# Altium schematic sheet Power_PMIC.SchDoc: Power_PMIC
size A3; Project: STM32MP15-DISCO PI; Date: Not used; ApprovedBy: Not used; CheckedBy: Not used; Author: Not used; CompanyName: STMicroelectronics; DrawnBy: Not used; Engineer: Not used; Organization: Not used; Address1: Not used; Address2: Not used; Address3: Not used; Address4: Not used; DocumentNumber: 4; Revision: Not used; SheetNumber: 5; SheetTotal: 15; CurrentTime: Not used; CurrentDate: Not used; Time: Not used; DocumentFullPathAndName: Not used; DocumentName: Not used; ModifiedDate: Not used; ImagePath: Not used; ProjectName: Not used; Application_BuildNumber: Not used
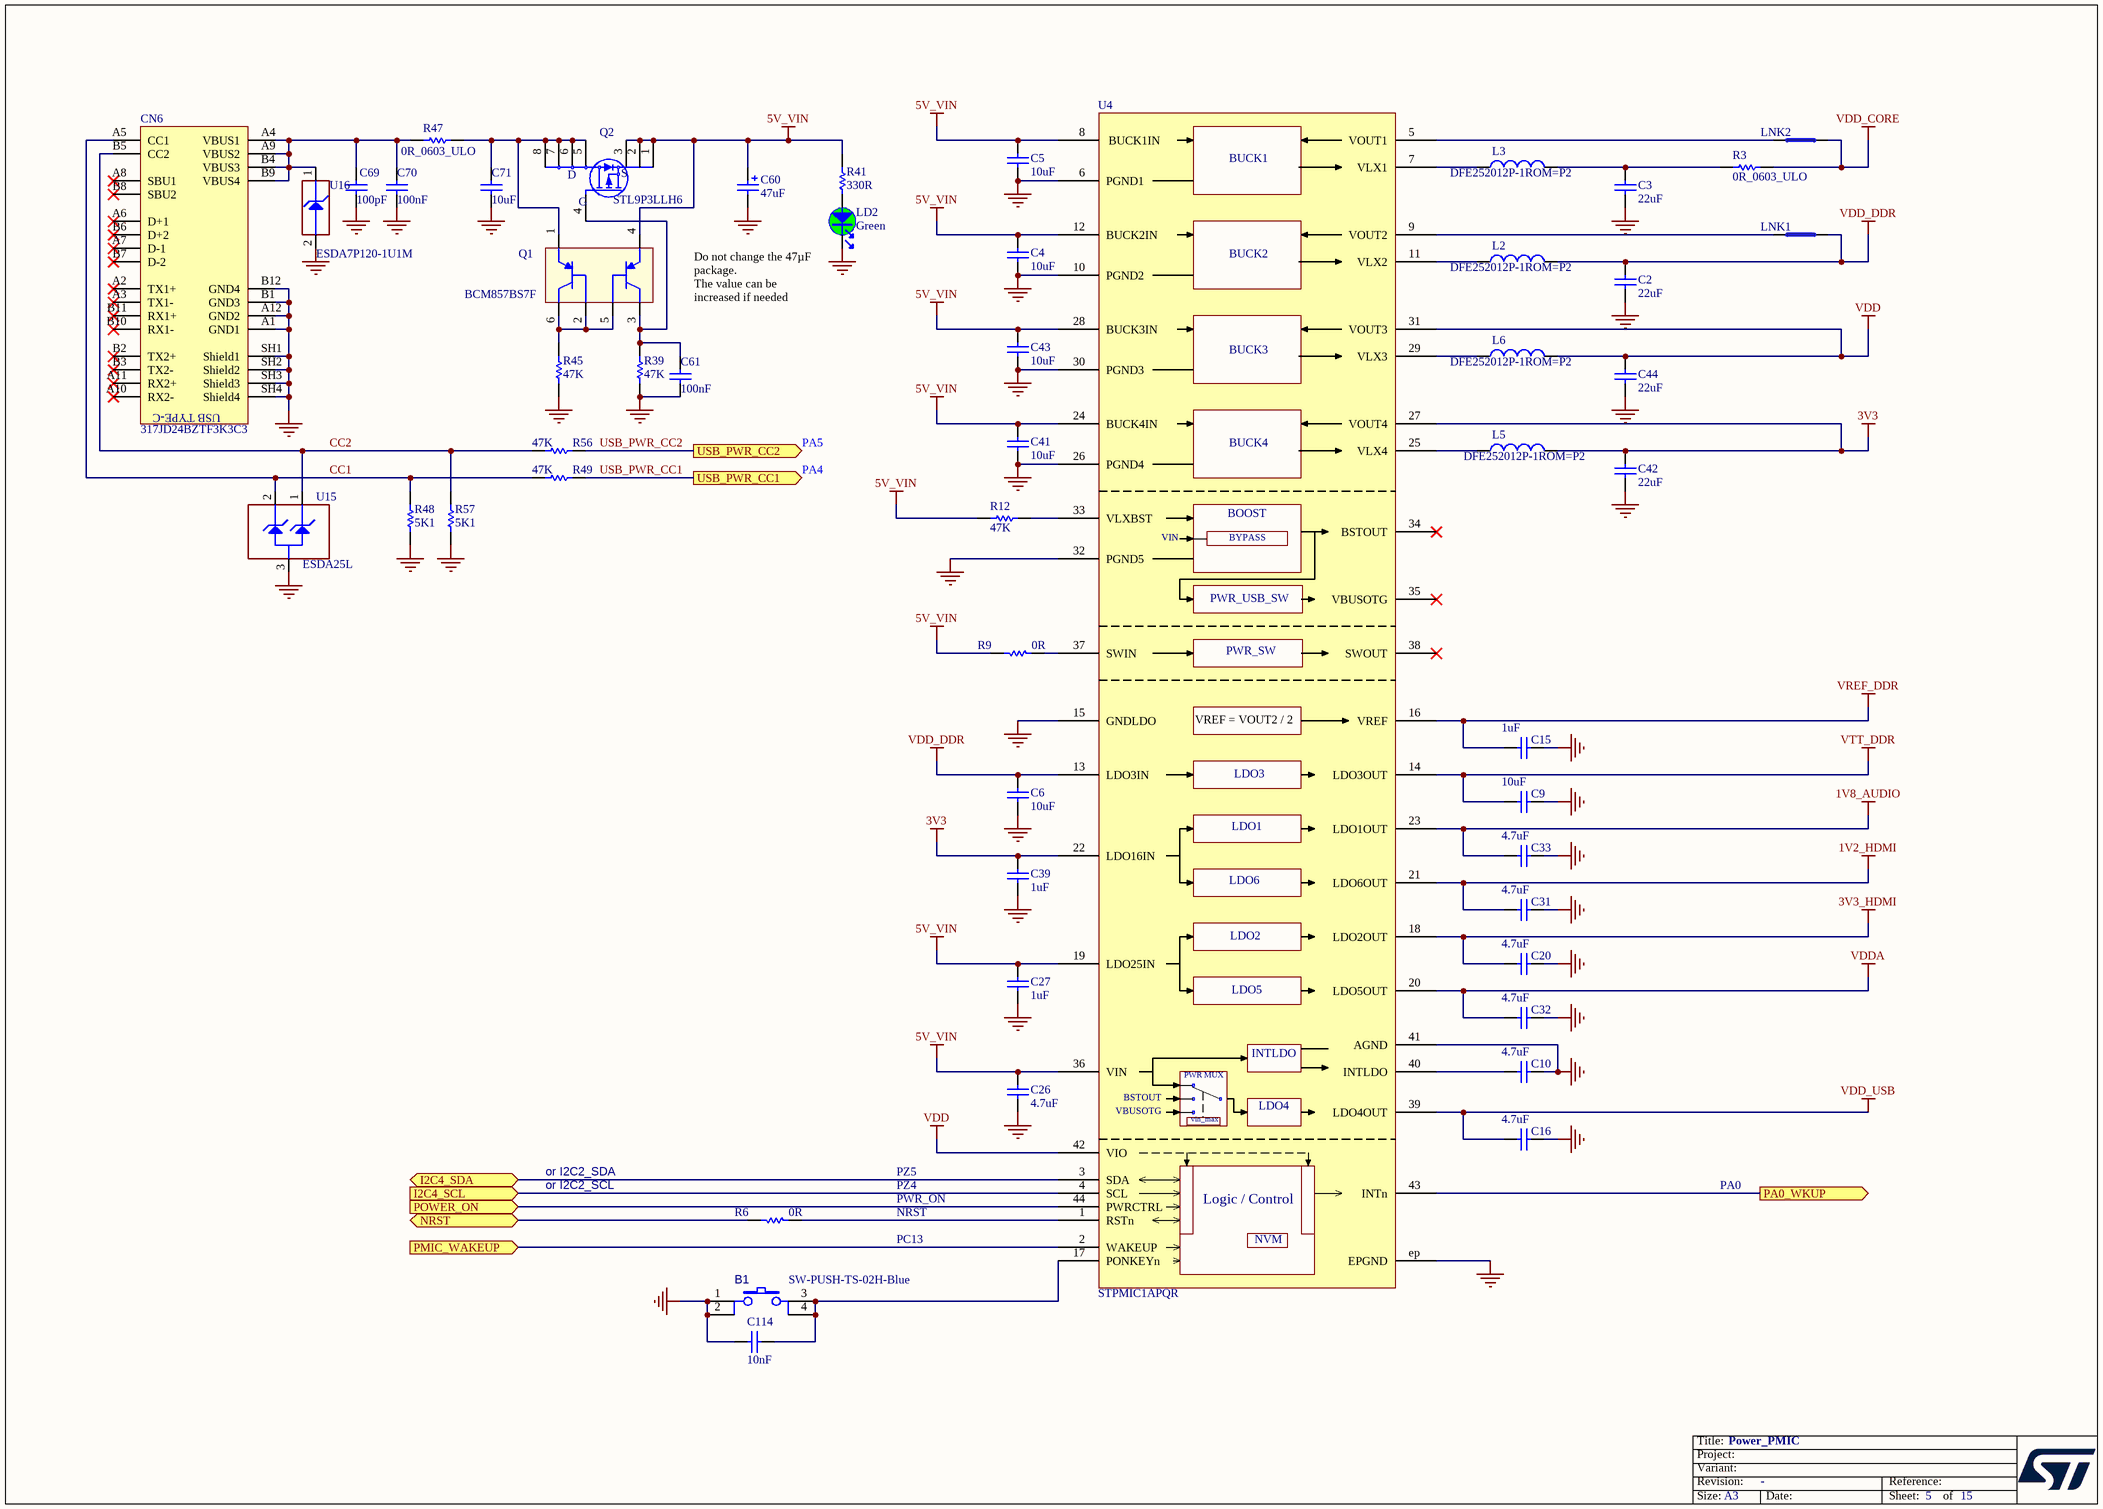
[diagram p0: Power_PMIC.SchDoc]

## Parts
B1  value SW-PUSH-TS-02H-Blue  [SWI_JIUBABA_C-TS-02H-2-5-B-V-T_R_BLUE]
C2  value 22uF  [C0603]
C3  value 22uF  [C0603]
C4  value 10uF  [C0603]
C5  value 10uF  [C0603]
C6  value 10uF  [C0603]
C9  value 10uF  [C0603]
C10  value 4.7uF  [C0402]  (hidden comment: Capacitor)
C15  value 1uF  [C0402]
C16  value 4.7uF  [C0402]  (hidden comment: Capacitor)
C20  value 4.7uF  [C0402]  (hidden comment: Capacitor)
C26  value 4.7uF  [C0402]  (hidden comment: Capacitor)
C27  value 1uF  [C0402]
C31  value 4.7uF  [C0402]  (hidden comment: Capacitor)
C32  value 4.7uF  [C0402]  (hidden comment: Capacitor)
C33  value 4.7uF  [C0402]  (hidden comment: Capacitor)
C39  value 1uF  [C0402]
C41  value 10uF  [C0603]
C42  value 22uF  [C0603]
C43  value 10uF  [C0603]
C44  value 22uF  [C0603]
C60  value 47uF  [CPOL_TAJ-C_2312_H2P6]  (hidden comment: Cap_POL_TANA)
C61  value 100nF  [C0402]
C69  value 100pF  [C0402]  (hidden comment: Capacitor)
C70  value 100nF  [C0402]
C71  value 10uF  [C0805]  (hidden comment: Capacitor)
C114  value 10nF  [C0402]
CN6  value 317JD24BZTF3K3C3  [CON_USB-TYPEC_COXOC_317JD24BZTF3K3C3]
L2  Manufacturer_Part_Number: DFE252012P-1ROM=P2  [IND_2520_TOKO_DFE252012P]  (hidden comment: IND_1uH_42mohm_3.2A)
L3  Manufacturer_Part_Number: DFE252012P-1ROM=P2  [IND_2520_TOKO_DFE252012P]  (hidden comment: IND_1uH_42mohm_3.2A)
L5  Manufacturer_Part_Number: DFE252012P-1ROM=P2  [IND_2520_TOKO_DFE252012P]  (hidden comment: IND_1uH_42mohm_3.2A)
L6  Manufacturer_Part_Number: DFE252012P-1ROM=P2  [IND_2520_TOKO_DFE252012P]  (hidden comment: IND_1uH_42mohm_3.2A)
LD2  value Green  [LED_0603_GREEN]  (hidden comment: LED_green)
LNK1  link_200  [LINK200]  (value not drawn)  (no BOM)
LNK2  link_200  [LINK200]  (value not drawn)  (no BOM)
Q1  value BCM857BS7F  [DIO_SOT363]
Q2  value STL9P3LLH6  [MOS_POWERFLAT_3P3X3P3_P065]
R3  value 0R_0603_ULO  [R0603]
R6  value 0R  [R0402]
R9  value 0R  [R0402]
R12  value 47K  [R0402]  (hidden comment: Resistor)
R39  value 47K  [R0402]  (hidden comment: Resistor)
R41  value 330R  [R0402]
R45  value 47K  [R0402]  (hidden comment: Resistor)
R47  value 0R_0603_ULO  [R0603]
R48  value 5K1  [R0402]  (hidden comment: Resistor)
R49  value 47K  [R0402]  (hidden comment: Resistor)
R56  value 47K  [R0402]  (hidden comment: Resistor)
R57  value 5K1  [R0402]  (hidden comment: Resistor)
U4  value STPMIC1APQR  [ICC_WFQFN44-EPAD_5X6_P040]  (hidden comment: STPMU1)
U15  value ESDA25L  [ESD_SOT23]  (hidden comment: New schematic symbol : correction 2 diodes instead of one)
U16  value ESDA7P120-1U1M  [ESD_QFN1610_2N_1K_2A]  (hidden comment: ​Footprint needed DFN105P160X60-2N)

## Ports
I2C4_SCL (in), I2C4_SDA (bidir), NRST (bidir), PA0_WKUP (out), PMIC_WAKEUP (in), POWER_ON (in), USB_PWR_CC1 (out), USB_PWR_CC2 (out)

## Nets
1V2_HDMI: C31.2 U4.21(LDO6OUT)
1V8_AUDIO: C33.2 U4.23(LDO1OUT)
3V3: C39.2 C42.2 L5.2 U4.22(LDO16IN) U4.27(VOUT4)
3V3_HDMI: C20.2 U4.18(LDO2OUT)
5V_VIN: C4.2 C5.2 C26.2 C27.2 C41.2 C43.2 C60.1 Q1.4(E2) Q2.1(S) Q2.2(S) Q2.3(S) R9.1 R12.2 R41.2 U4.8(BUCK1IN) U4.12(BUCK2IN) U4.19(LDO25IN) U4.24(BUCK4IN) U4.28(BUCK3IN) U4.36(VIN)
GND: B1.1 B1.2 C2.1 C3.1 C4.1 C5.1 C6.1 C9.1 C10.2 C15.1 C16.1 C20.1 C26.1 C27.1 C31.1 C32.1 C33.1 C39.1 C41.1 C42.1 C43.1 C44.1 C60.2 C61.2 C69.1 C70.2 C71.1 C114.1 CN6.A1(GND1) CN6.A12(GND2) CN6.B1(GND3) CN6.B12(GND4) CN6.SH1(Shield1) CN6.SH2(Shield2) CN6.SH3(Shield3) CN6.SH4(Shield4) LD2.2 R39.1 R45.1 R48.1 R57.1 U4.6(PGND1) U4.10(PGND2) U4.15(GNDLDO) U4.26(PGND4) U4.30(PGND3) U4.32(PGND5) U4.41(AGND) U4.ep(EPGND) U15.3(GND) U16.2(GND)
VDD: C44.2 L6.2 U4.31(VOUT3) U4.42(VIO)
VDD_CORE: LNK2.2 R3.2
VDD_DDR: C2.2 C6.2 L2.2 LNK1.2 U4.13(LDO3IN)
VDD_USB: C16.2 U4.39(LDO4OUT)
VDDA: C32.2 U4.20(LDO5OUT)
VREF_DDR: C15.2 U4.16(VREF)
VTT_DDR: C9.2 U4.14(LDO3OUT)
CC1: CN6.A5(CC1) R48.2 R49.1 U15.2(IO2)
CC2: CN6.B5(CC2) R56.1 R57.2 U15.1(IO1)
I2C4_SCL: U4.4(SCL) ; port I2C4_SCL
I2C4_SDA: U4.3(SDA) ; port I2C4_SDA
NRST: R6.1 ; port NRST
PA0_WKUP: U4.43(INTn) ; port PA0_WKUP
PMIC_WAKEUP: U4.2(WAKEUP) ; port PMIC_WAKEUP
POWER_ON: U4.44(PWRCTRL) ; port POWER_ON
USB_PWR_CC1: R49.2 ; port USB_PWR_CC1
USB_PWR_CC2: R56.2 ; port USB_PWR_CC2
NetB1_3: B1.3 B1.4 C114.2 U4.17(PONKEYn)
NetC3_2: C3.2 L3.2 R3.1
NetC10_1: C10.1 U4.40(INTLDO)
NetC61_1: C61.1 Q1.3(C2) Q2.4(G) R39.2
NetC69_2: C69.2 C70.1 CN6.A4(VBUS1) CN6.A9(VBUS2) CN6.B4(VBUS3) CN6.B9(VBUS4) R47.1 U16.1(IO1)
NetC71_2: C71.2 Q1.1(E1) Q2.5(D) Q2.6(D) Q2.7(D) Q2.8(D) R47.2
NetL2_1: L2.1 U4.11(VLX2)
NetL3_1: L3.1 U4.7(VLX1)
NetL5_1: L5.1 U4.25(VLX4)
NetL6_1: L6.1 U4.29(VLX3)
NetLD2_1: LD2.1 R41.1
NetLNK1_1: LNK1.1 U4.9(VOUT2)
NetLNK2_1: LNK2.1 U4.5(VOUT1)
NetQ1_2: Q1.2(B1) Q1.5(B2) Q1.6(C1) R45.2
NetR6_2: R6.2 U4.1(RSTn)
NetR9_2: R9.2 U4.37(SWIN)
NetR12_1: R12.1 U4.33(VLXBST)

Not connected (* = marked no-connect by the designer): CN6 A2(TX1+)* A3(TX1-)* A6(D+1)* A7(D-1)* A8(SBU1)* A10(RX2-)* A11(RX2+)* B2(TX2+)* B3(TX2-)* B6(D+2)* B7(D-2)* B8(SBU2)* B10(RX1-)* B11(RX1+)*; U4 34(BSTOUT)* 35(VBUSOTG)* 38(SWOUT)*

## Notes on the sheet
- (near LD2) Do not change the 47µF package.
  The value can be increased if needed
- PA5
- PA4
- or I2C2_SDA
- or I2C2_SCL
- PZ5
- PZ4
- PA0
- NRST
- PWR_ON
- PC13
- Title:
- Project:
- Size:
- Revision:
- Variant:
- A3
- -
- Date:
- Reference:
- Sheet:
- of
- (in symbol MCD-01108) USB TYPE-C
- (in symbol MCD-01650) BUCK1; BUCK2; BUCK3; BUCK4; BOOST; BYPASS; PWR_USB_SW; PWR_SW; VREF = VOUT2 / 2; LDO3; LDO1; LDO6; LDO2; LDO5; PWR MUX; LDO4; vin_max; Logic / Control; NVM

## Library data of the parts
B1 = MCD-00172: Switch HW SMD blue; Part_Type: Misc; Manufacturer_Part_Number: C-TS-02H-2.5-B-V-T/R BLUE; Manufacturer: JIUBABA; Provided_By: SUBCO; Initial_Board_Reference: MB1264; Internal_Part_Number: MCD-00172; Status: Checked; ComponentLink1Description: Datasheet; ComponentLink1URL: http://tunmcdsvn.tun.st.com/Component_Datasheet_Library/Trunk/Misc/Jiubaba_TS-02H-H2-5
C2 C3 C42 C44 = MCD-00100: Capacitor, MLCC, 22uF, 6V3, X5R, 20%, 0603, T=0,8mm; Manufacturer_Part_Number: GRM188R60J226MEA0J; Manufacturer: MURATA; ECCN_US: EAR99; ECCN_EU: NEC; Provided_By: SUBCO; Initial_Board_Reference: mb1262; Internal_Part_Number: MCD-00100; Status: Released; Part_Type: Capacitor; Package: C0603; ComponentLink1Description: Datasheet; ComponentLink1URL: http://tunmcdsvn.tun.st.com/Component_Datasheet_Library/Trunk/Capacitors/Murata_Capacitor_GR_series
C4-C6 C9 C41 C43 = MCD-00099: Capacitor, MLCC, 10uF, 10V, X5R, 10%, 0603, T=0,8mm; Manufacturer_Part_Number: GRM188R61A106KE69D; Manufacturer: MURATA; ECCN_US: EAR99; ECCN_EU: NEC; Provided_By: SUBCO; Initial_Board_Reference: mb1262; Internal_Part_Number: MCD-00099; Status: Released; Part_Type: Capacitor; Package: C0603; ComponentLink1Description: Datasheet; ComponentLink1URL: http://tunmcdsvn.tun.st.com/Component_Datasheet_Library/Trunk/Capacitors/Murata_Capacitor_GR_series
C10 C16 C20 C26 C31-C33 = MCD-01356: Capacitor, MLCC, 4.7uF, 6V3, X5R, 20%, 0402, T=0,5mm; Manufacturer_Part_Number: GRM155R60J475ME47; Manufacturer: MURATA; Provided_By: SUBCO; Internal_Part_Number: MCD-01356; Status: Released; Part_Type: Capacitor; Package: C0402; ComponentLink1Description: Datasheet; ComponentLink1URL: http://tunmcdsvn.tun.st.com/Component_Datasheet_Library/Trunk/Capacitors/Murata_Capacitor_GR_series
C15 C27 C39 = MCD-00095: Capacitor, MLCC, 1uF, 6V3, X5R, 10%, 0402, T=0,5mm; Manufacturer_Part_Number: GRM155R61E105KA12; Manufacturer: MURATA; Alternate_Manufacturer_Part_Number: GRM155R60J105KE19; ECCN_US: EAR99; ECCN_EU: NEC; Provided_By: SUBCO; Initial_Board_Reference: mb1262; Internal_Part_Number: MCD-00095; Status: Released; Part_Type: Capacitor; Package: C0402; ComponentLink1Description: Datasheet; ComponentLink1URL: http://tunmcdsvn.tun.st.com/Component_Datasheet_Library/Trunk/Capacitors/Murata_Capacitor_GR_series; Alternate_Manufacturer: MURATA
C60 = MCD-00559: Capacitor, Tantalum, 47uF, 16V, 10%, TypeC; Manufacturer_Part_Number: TAJC476K016RNJ; Manufacturer: AVX; Provided_By: SUBCO; Initial_Board_Reference: MB1331; Revision: July-2002: Re-released for DXP Platform.; Internal_Part_Number: MCD-00559; Status: Footprint available; Part_Type: Capacitor; Package: C2312; ComponentLink1Description: Datasheet; ComponentLink1URL: http://tunmcdsvn.tun.st.com/Component_Datasheet_Library/Trunk/Capacitors/AVX_Capacitor_TAJ-series; ECCN_US: n/a; ECCN_EU: n/a
C61 C70 = MCD-00006: Capacitor,100nF,16V,X7R,10%,0402; Manufacturer_Part_Number: CC0402KRX7R7BB104; Manufacturer: YAGEO; Alternate_Manufacturer: MURATA; Alternate_Manufacturer_Part_Number: GCM155R71C104KA55D; Provided_By: SUBCO; Initial_Board_Reference: mb1274; Internal_Part_Number: MCD-00006; ComponentLink1Description: Datasheet; ECCN_US: n/a; ECCN_EU: n/a; Status: Released; Part_Type: Capacitor; Package: C0402; ComponentLink1URL: http://tunmcdsvn.tun.st.com/Component_Datasheet_Library/Trunk/Capacitors/Yageo_Multilayer_Capacitor_X7R_series_100pF_to_22uF
C69 = MCD-00205: Capacitor, MLCC, 100pF, 50V, NPO, 5%, 0402, T=0,5mm; Manufacturer_Part_Number: CC0402JRNPO9BN101; Manufacturer: YAGEO; Provided_By: SUBCO; Internal_Part_Number: MCD-00205; Status: Released; Part_Type: Capacitor; Package: C0402; ComponentLink1Description: Datasheet; ComponentLink1URL: http://tunmcdsvn.tun.st.com/Component_Datasheet_Library/Trunk/Capacitors/Yageo_Capacitor_NP0_16V-to-50V
C71 = MCD-00014: Capacitor, MLCC, 10uF, 25V, X5R, 10%, 0805, T=0,85mm; Manufacturer_Part_Number: CC0805KRX5R8BB106; Manufacturer: YAGEO; Provided_By: SUBCO; Initial_Board_Reference: MB1274; Internal_Part_Number: MCD-00014; Status: Released; Part_Type: Capacitor; Package: C0805; ComponentLink1Description: Datasheet; ComponentLink1URL: http://tunmcdsvn.tun.st.com/Component_Datasheet_Library/Trunk/Capacitors/Yageo_Multilayer_capacitor_X5R_series_100pF_to_100uF; ECCN_US: n/a; ECCN_EU: n/a
C114 = MCD-00011: Capacitor, MLCC, 10nF, 16V, X7R, 10%, 0402, T=0.5mm; Manufacturer_Part_Number: CC0402KRX7R7BB103; Manufacturer: YAGEO; Provided_By: SUBCO; Initial_Board_Reference: mb1274; Internal_Part_Number: MCD-00011; Status: Released; Part_Type: Capacitor; Package: C0402; ComponentLink1Description: Datasheet; ComponentLink1URL: http://tunmcdsvn.tun.st.com/Component_Datasheet_Library/Trunk/Capacitors/Yageo_Multilayer_Capacitor_X7R_series_100pF_to_22uF; ECCN_US: n/a; ECCN_EU: n/a
CN6 = MCD-01108: USB tyce C certified receptacle for 1.6mm pcb height; Part_Type: Connector; Manufacturer: CHANT SINCERE (COXOC); ECCN_US: NA; Provided_By: SUBCO; Initial_Board_Reference: MB1272; Internal_Part_Number: MCD-01108; Status: Released; Manufacturer_Part_Number: 317JD24BZTF3K3C3; ComponentLink1Description: Datasheet; ComponentLink1URL: http://tunmcdsvn.tun.st.com/Component_Datasheet_Library/Trunk/Connectors/Chant%20sincere_usb%20type%20C%20connector%20317JD24BZTF3K3C3; ECCN_EU: NA
L2 L3 L5 L6 = MCD-01122: Power Inductor ,1µH,4.3A max,+-20%,0.042ohm,2520; Manufacturer: MURATA; ECCN_US: EAR99; Provided_By: SUBCO; Initial_Board_Reference: MB1272; Value: 1µH; Internal_Part_Number: MCD-01122; Status: Footprint available; Part_Type: Inductor; Package: 2520; ComponentLink1Description: Datasheet; ComponentLink1URL: http://tunmcdsvn.tun.st.com/Component_Datasheet_Library/Trunk/Inductors/Murata_Power_inductors_DFE252012P-1ROM=P2/Murata_Power_inductors_dfe252012p.pdf; ECCN_EU: EAR99
LD2 = MCD-02900: LED, Green, 2V, 20mA, 0603; Part_Type: Display; Part_Preference: Recommended; Manufacturer: EVERLIGHT; Manufacturer_Part_Number: 19-213SYGC/S530-E2/5T; Full_Alternate_Internal_Part_Number: MCD-00320; Partial_Alternate_Internal_Part_Number: MCD-00050; Component_Country_Of_Origin: China; ShowFields: YES; ID: 5016; Internal_Part_Number: MCD-02900; Status: Checked; Package: 0603; ComponentLink1URL: http://tunmcdsvn.tun.st.com/Component_Documentation_Library/Trunk/Display/EVERLIGHT_19-213SYGC-S530-E2-5T; Order_Code_Digikey: 1080-19-213SYGC/S530-E2/5TTR-ND; Order_Code_Farnell: N/A; Order_Code_RS: N/A
LNK1 LNK2 = link_200: link 0.2mm; Value: link_200
Q1 = MCD-01120: Transistor 45V Matched Pair PNP small Signal transistor in SOT363; Part_Type: IC; Manufacturer: DIODES_INC; Alternate_Manufacturer_Part_Number: NST45010MW6T1G; Alternate_Manufacturer: ONSEMI; Provided_By: SUBCO; Initial_Board_Reference: MB1272; Internal_Part_Number: MCD-01120; Status: Checked; Manufacturer_Part_Number: BCM857BS7F; Package: SOT363; ComponentLink1Description: Datasheet; ComponentLink1URL: http://tunmcdsvn.tun.st.com/Component_Datasheet_Library/Trunk/IC/DIODES_INC_Dual_PNP_Transistors_BCM857BS7F/DIODES_INC_Dual_PNP_Transistors_BCM857BS7F.pdf
Q2 = MCD-01126: Power Mosfet, P-channel,VDS -30V,RDS 12mohm typ,ID -9A; Part_Type: IC; Manufacturer: STMICROELECTRONICS; ECCN_US: EAR99; ECCN_EU: NEC; Provided_By: SUBCO with ST control; Initial_Board_Reference: MB1272; Internal_Part_Number: MCD-01126; Status: Checked; Manufacturer_Part_Number: STL9P3LLH6; Package: PowerFLAT 3.3x3.3; ComponentLink1Description: Datasheet; ComponentLink1URL: http://tunmcdsvn.tun.st.com/Component_Datasheet_Library/Trunk/IC/STM_POWER_MOSFET_P_STL9P3LLH6
R3 R47 = MCD-00181: Resistor,0R,0603,ULO; Manufacturer_Part_Number: PMR03EZPJ000; Manufacturer: ROHM; Provided_By: SUBCO; Internal_Part_Number: MCD-00181; Status: Released; Part_Type: Resistor; Package: R0603; ComponentLink1Description: Datasheet; ComponentLink1URL: http://tunmcdsvn.tun.st.com/Component_Datasheet_Library/Trunk/Resistors/ROHM_ULtra_low_Ohmic_Resistor_PMR10EZPJ000; ECCN_US: n/a; ECCN_EU: n/a
R6 R9 = MCD-00052: Resistor,0R,0402,5%,1/16W; Manufacturer_Part_Number: RC0402JR-070RL; Manufacturer: YAGEO; Provided_By: SUBCO; Initial_Board_Reference: mb1274; Internal_Part_Number: MCD-00052; Status: Released; Part_Type: Resistor; Package: R0402; ComponentLink1Description: Datasheet; ComponentLink1URL: http://tunmcdsvn.tun.st.com/Component_Datasheet_Library/Trunk/Resistors/Yageo_Resistor_RC0402-series; ECCN_US: n/a; ECCN_EU: n/a
R12 R39 R45 R49 R56 = MCD-00063: Resistor,47K,0402,1%,1/16W; Manufacturer_Part_Number: RC0402FR-0747KL; Manufacturer: YAGEO; Provided_By: SUBCO; Initial_Board_Reference: MB1274; Internal_Part_Number: MCD-00063; Status: Released; Part_Type: Resistor; Package: R0402; ComponentLink1Description: Datasheet; ComponentLink1URL: http://tunmcdsvn.tun.st.com/Component_Datasheet_Library/Trunk/Resistors/Yageo_Resistor_RC0402-series; ECCN_US: n/a; ECCN_EU: n/a
R41 = MCD-00062: Resistor,330R,0402,1%,1/16W; Manufacturer_Part_Number: RC0402FR-07330RL; Manufacturer: YAGEO; Provided_By: SUBCO; Initial_Board_Reference: mb1274; Internal_Part_Number: MCD-00062; Status: Released; Part_Type: Resistor; Package: R0402; ComponentLink1Description: Datasheet; ComponentLink1URL: http://tunmcdsvn.tun.st.com/Component_Datasheet_Library/Trunk/Resistors/Yageo_Resistor_RC0402-series; ECCN_US: n/a; ECCN_EU: n/a
R48 R57 = MCD-00333: Resistor,5K1,0402,1%,1/16W; Manufacturer_Part_Number: RC0402FR-075K1L; Manufacturer: YAGEO; Provided_By: SUBCO; Initial_Board_Reference: MB1272; Internal_Part_Number: MCD-00333; Status: Released; Part_Type: Resistor; Package: R0402; ComponentLink1Description: Datasheet; ComponentLink1URL: http://tunmcdsvn.tun.st.com/Component_Datasheet_Library/Trunk/Resistors/Yageo_Resistor_RC0402-series; ECCN_US: n/a; ECCN_EU: n/a
U4 = MCD-01650: ST PMIC:  4 step-down + 1 advanced boost SMPS, 6 LDOs, 2 pwr switches, DDR Vref, NVM option 'A' for IO@3.3V; Part_Type: IC; Manufacturer: STMICROELECTRONICS; Provided_By: SUBCO with ST control; Internal_Part_Number: MCD-01650; Status: Footprint available; Manufacturer_Part_Number: STPMIC1APQR; Package: WFQFN 5.0x6.0x0.80mm; ComponentLink1Description: Datasheet; ComponentLink1URL: http://tunmcdsvn.tun.st.com/Component_Datasheet_Library/Trunk/IC/STM_PMIC_LuftBurg_5x6_44L_20_01_2016
U15 = MCD-01125: DUAL TRANSIL ARRAY FOR ESD PROTECTION; Part_Type: Diode; Manufacturer: STMICROELECTRONICS; BMS_Part_Number: 9151131; ECCN_US: EAR99; ECCN_EU: NEC; Provided_By: SUBCO with ST control; Initial_Board_Reference: MB1272; Internal_Part_Number: MCD-01125; Status: Checked; Manufacturer_Part_Number: ESDA25L; Package: ESD_SOT23; ComponentLink1Description: Datasheet; ComponentLink1URL: http://tunmcdsvn.tun.st.com/Component_Datasheet_Library/Trunk/Diodes/STM_ESD_ESDA25L
U16 = MCD-01026: High power transient voltage suppressor; Part_Type: Diode; Manufacturer: STMICROELECTRONICS; BMS_Part_Number: 9179046; ECCN_US: EAR99; ECCN_EU: NEC; Provided_By: SUBCO with ST control; Initial_Board_Reference: MB1378; Internal_Part_Number: MCD-01026; Status: Released; Manufacturer_Part_Number: ESDA7P120-1U1M; Package: QFN1610; ComponentLink1Description: Datasheet; ComponentLink1URL: http://tunmcdsvn.tun.st.com/Component_Datasheet_Library/Trunk/Diodes/STM_ESD_ESDA7P120-1U1M